# Altium schematic sheet Power.SchDoc
size A
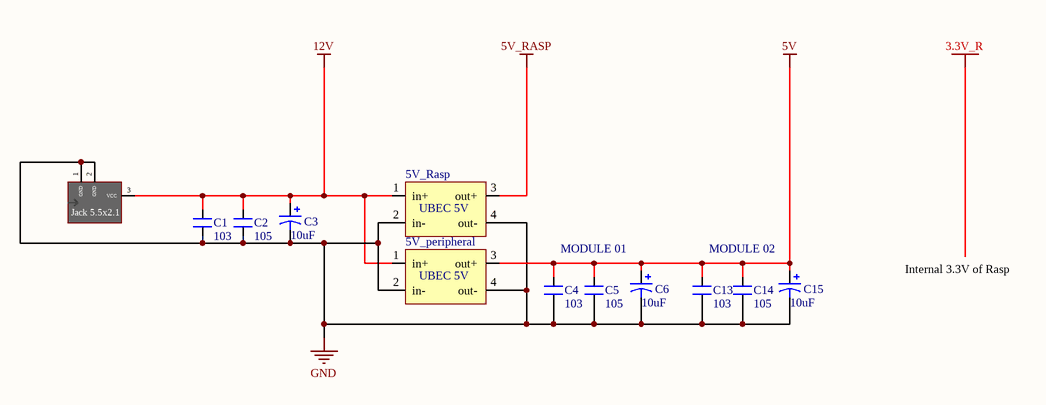
[diagram p0: Power.SchDoc]

## Parts
5V_peripheral  UBEC  [UBEC]  (value not drawn)
5V_Rasp  UBEC  [UBEC]  (value not drawn)
C1  103  [CN1]
C2  105  [CN1]
C3  10uF  [CP2/5]
C4  103  [CN1]
C5  105  [CN1]
C6  10uF  [CP2/5]
C13  103  [CN1]
C14  105  [CN1]
C15  10uF  [CP2/5]
J1  5#DC Jack 2.54mm  [5#DC Jack 2.54mm]  (value not drawn)

## Nets
5V: 5V_peripheral.3(out+) C4.2 C5.2 C6.1 C13.2 C14.2 C15.1
5V_RASP: 5V_Rasp.3(out+)
12V: 5V_peripheral.1(in+) 5V_Rasp.1(in+) C1.2 C2.2 C3.1 J1.3(VCC)
GND: 5V_peripheral.2(in-) 5V_peripheral.4(out-) 5V_Rasp.2(in-) 5V_Rasp.4(out-) C1.1 C2.1 C3.2 C4.1 C5.1 C6.2 C13.1 C14.1 C15.2 J1.1(GND) J1.2(GND)

## Notes on the sheet
- 3.3V_R
- MODULE 01
- MODULE 02
- Internal 3.3V of Rasp
- (in symbol 5#DC Jack 2.54mm) Jack 5.5x2.1
- (in symbol UBEC) UBEC 5V

## Library data of the parts
C1 C2 C4 C5 C13 C14 = CN1: Cap np  1pF - 472pF; Value: 100pF
C3 = Cap Pol3_1: Polarized Capacitor (Surface Mount); Name: C3; LatestRevisionDate: 17-Jul-2002; LatestRevisionNote: Re-released for DXP Platform.; PackageReference: C0805; Publisher: Altium Limited; Value: 10uF
C6 = Cap Pol3_1: Polarized Capacitor (Surface Mount); Name: C6; LatestRevisionDate: 17-Jul-2002; LatestRevisionNote: Re-released for DXP Platform.; PackageReference: C0805; Publisher: Altium Limited; Value: 10uF
C15 = Cap Pol3_1: Polarized Capacitor (Surface Mount); Name: C15; LatestRevisionDate: 17-Jul-2002; LatestRevisionNote: Re-released for DXP Platform.; PackageReference: C0805; Publisher: Altium Limited; Value: 10uF